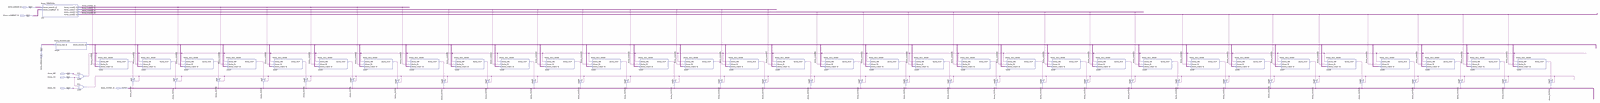
[diagram p0: schematic sheet, whole]
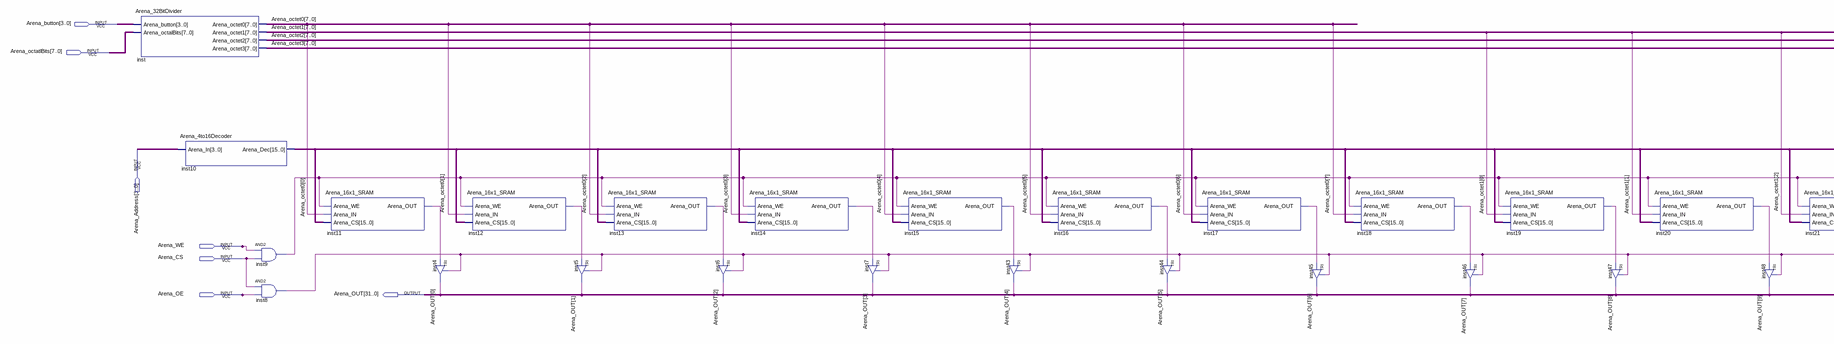
[diagram p1: schematic sheet, left part]
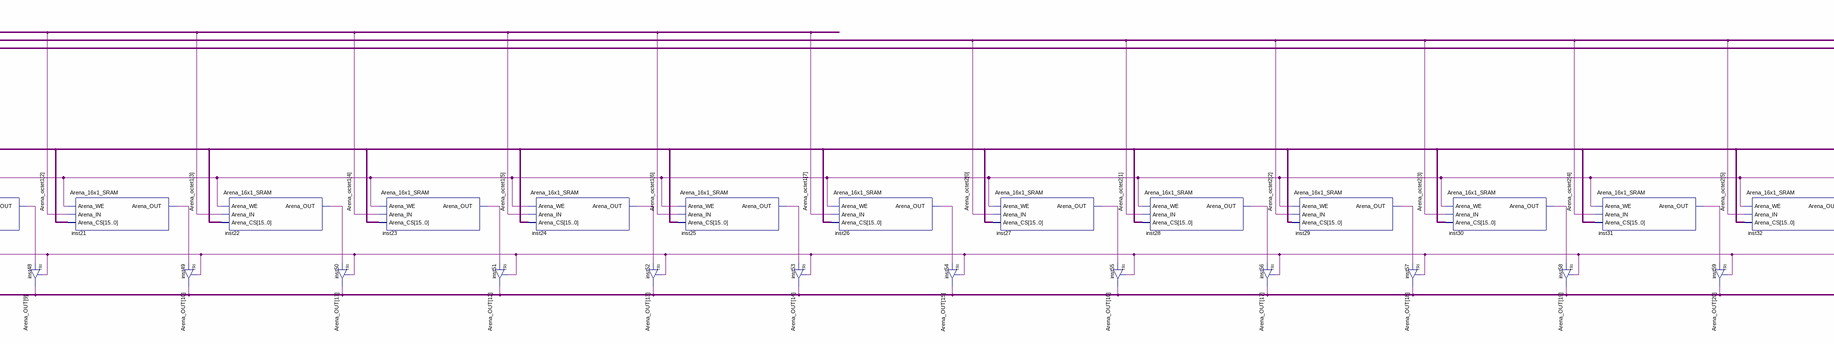
[diagram p2: schematic sheet, centre part]
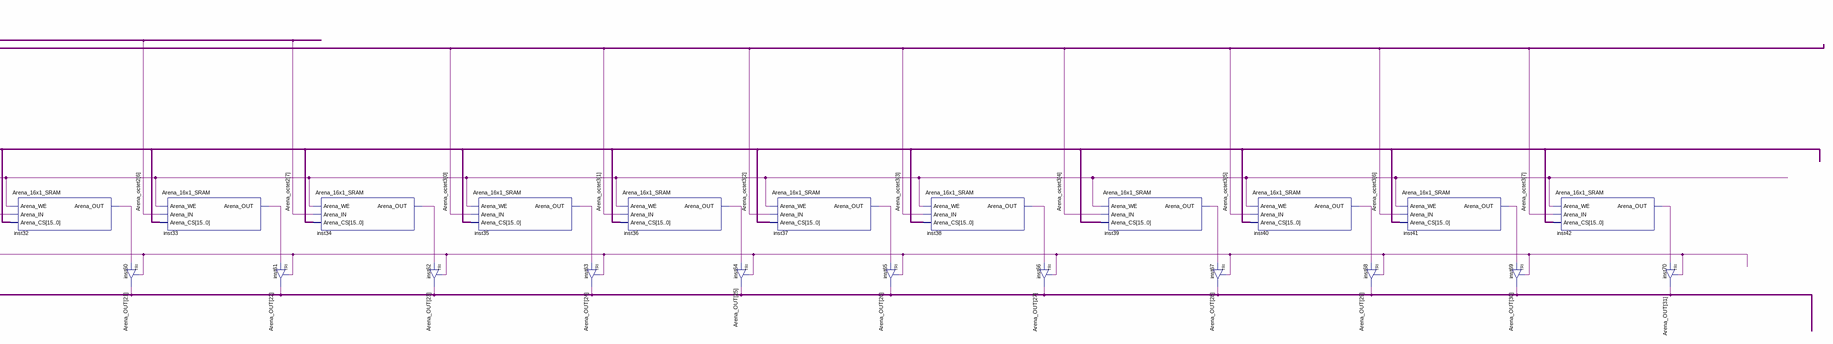
[diagram p3: schematic sheet, right part]
// Quartus schematic Arena_16x32_SRAM.bdf as structural Verilog: 68 symbols, 7 pins
module Arena_16x32_SRAM (
  input  [3:0] Arena_button,
  input  [7:0] Arena_octatlBits,
  input  [3:0] Arena_Address,
  input  Arena_WE,
  input  Arena_CS,
  input  Arena_OE,
  output [31:0] Arena_OUT
);

  wire inst8_out, inst9_out, inst11_arena_out, inst12_arena_out, inst13_arena_out, inst14_arena_out,
       inst15_arena_out, inst16_arena_out, inst17_arena_out, inst18_arena_out, inst19_arena_out,
       inst20_arena_out, inst21_arena_out, inst22_arena_out, inst23_arena_out, inst24_arena_out,
       inst25_arena_out, inst26_arena_out, inst27_arena_out, inst28_arena_out, inst29_arena_out,
       inst30_arena_out, inst31_arena_out, inst32_arena_out, inst33_arena_out, inst34_arena_out,
       inst35_arena_out, inst36_arena_out, inst37_arena_out, inst38_arena_out, inst39_arena_out,
       inst40_arena_out, inst41_arena_out, inst42_arena_out;
  wire [7:0] Arena_octet0, Arena_octet1, Arena_octet2, Arena_octet3;
  wire [15:0] inst10_arena_dec;

  Arena_32BitDivider inst (
    .Arena_button(Arena_button), .Arena_octalBits(Arena_octatlBits), .Arena_octet0(Arena_octet0),
    .Arena_octet1(Arena_octet1), .Arena_octet2(Arena_octet2), .Arena_octet3(Arena_octet3));
  Arena_4to16Decoder inst10 (.Arena_In(Arena_Address), .Arena_Dec(inst10_arena_dec));
  and inst9 (inst9_out, Arena_WE, Arena_CS);
  and inst8 (inst8_out, Arena_CS, Arena_OE);
  Arena_16x1_SRAM inst11 (
    .Arena_WE(inst9_out), .Arena_IN(Arena_octet0[0]), .Arena_CS(inst10_arena_dec),
    .Arena_OUT(inst11_arena_out));
  TRI inst4 (.IN(inst11_arena_out), .OE(inst8_out), .OUT(Arena_OUT[0]));
  Arena_16x1_SRAM inst12 (
    .Arena_WE(inst9_out), .Arena_IN(Arena_octet0[1]), .Arena_CS(inst10_arena_dec),
    .Arena_OUT(inst12_arena_out));
  TRI inst5 (.IN(inst12_arena_out), .OE(inst8_out), .OUT(Arena_OUT[1]));
  Arena_16x1_SRAM inst13 (
    .Arena_WE(inst9_out), .Arena_IN(Arena_octet0[2]), .Arena_CS(inst10_arena_dec),
    .Arena_OUT(inst13_arena_out));
  TRI inst6 (.IN(inst13_arena_out), .OE(inst8_out), .OUT(Arena_OUT[2]));
  Arena_16x1_SRAM inst14 (
    .Arena_WE(inst9_out), .Arena_IN(Arena_octet0[3]), .Arena_CS(inst10_arena_dec),
    .Arena_OUT(inst14_arena_out));
  TRI inst7 (.IN(inst14_arena_out), .OE(inst8_out), .OUT(Arena_OUT[3]));
  Arena_16x1_SRAM inst15 (
    .Arena_WE(inst9_out), .Arena_IN(Arena_octet0[4]), .Arena_CS(inst10_arena_dec),
    .Arena_OUT(inst15_arena_out));
  TRI inst43 (.IN(inst15_arena_out), .OE(inst8_out), .OUT(Arena_OUT[4]));
  Arena_16x1_SRAM inst16 (
    .Arena_WE(inst9_out), .Arena_IN(Arena_octet0[5]), .Arena_CS(inst10_arena_dec),
    .Arena_OUT(inst16_arena_out));
  TRI inst44 (.IN(inst16_arena_out), .OE(inst8_out), .OUT(Arena_OUT[5]));
  Arena_16x1_SRAM inst17 (
    .Arena_WE(inst9_out), .Arena_IN(Arena_octet0[6]), .Arena_CS(inst10_arena_dec),
    .Arena_OUT(inst17_arena_out));
  TRI inst45 (.IN(inst17_arena_out), .OE(inst8_out), .OUT(Arena_OUT[6]));
  Arena_16x1_SRAM inst18 (
    .Arena_WE(inst9_out), .Arena_IN(Arena_octet0[7]), .Arena_CS(inst10_arena_dec),
    .Arena_OUT(inst18_arena_out));
  TRI inst46 (.IN(inst18_arena_out), .OE(inst8_out), .OUT(Arena_OUT[7]));
  Arena_16x1_SRAM inst19 (
    .Arena_WE(inst9_out), .Arena_IN(Arena_octet1[0]), .Arena_CS(inst10_arena_dec),
    .Arena_OUT(inst19_arena_out));
  TRI inst47 (.IN(inst19_arena_out), .OE(inst8_out), .OUT(Arena_OUT[8]));
  Arena_16x1_SRAM inst20 (
    .Arena_WE(inst9_out), .Arena_IN(Arena_octet1[1]), .Arena_CS(inst10_arena_dec),
    .Arena_OUT(inst20_arena_out));
  TRI inst48 (.IN(inst20_arena_out), .OE(inst8_out), .OUT(Arena_OUT[9]));
  Arena_16x1_SRAM inst21 (
    .Arena_WE(inst9_out), .Arena_IN(Arena_octet1[2]), .Arena_CS(inst10_arena_dec),
    .Arena_OUT(inst21_arena_out));
  TRI inst49 (.IN(inst21_arena_out), .OE(inst8_out), .OUT(Arena_OUT[10]));
  Arena_16x1_SRAM inst22 (
    .Arena_WE(inst9_out), .Arena_IN(Arena_octet1[3]), .Arena_CS(inst10_arena_dec),
    .Arena_OUT(inst22_arena_out));
  TRI inst50 (.IN(inst22_arena_out), .OE(inst8_out), .OUT(Arena_OUT[11]));
  Arena_16x1_SRAM inst23 (
    .Arena_WE(inst9_out), .Arena_IN(Arena_octet1[4]), .Arena_CS(inst10_arena_dec),
    .Arena_OUT(inst23_arena_out));
  TRI inst51 (.IN(inst23_arena_out), .OE(inst8_out), .OUT(Arena_OUT[12]));
  Arena_16x1_SRAM inst24 (
    .Arena_WE(inst9_out), .Arena_IN(Arena_octet1[5]), .Arena_CS(inst10_arena_dec),
    .Arena_OUT(inst24_arena_out));
  TRI inst52 (.IN(inst24_arena_out), .OE(inst8_out), .OUT(Arena_OUT[13]));
  Arena_16x1_SRAM inst25 (
    .Arena_WE(inst9_out), .Arena_IN(Arena_octet1[6]), .Arena_CS(inst10_arena_dec),
    .Arena_OUT(inst25_arena_out));
  TRI inst53 (.IN(inst25_arena_out), .OE(inst8_out), .OUT(Arena_OUT[14]));
  Arena_16x1_SRAM inst26 (
    .Arena_WE(inst9_out), .Arena_IN(Arena_octet1[7]), .Arena_CS(inst10_arena_dec),
    .Arena_OUT(inst26_arena_out));
  TRI inst54 (.IN(inst26_arena_out), .OE(inst8_out), .OUT(Arena_OUT[15]));
  Arena_16x1_SRAM inst27 (
    .Arena_WE(inst9_out), .Arena_IN(Arena_octet2[0]), .Arena_CS(inst10_arena_dec),
    .Arena_OUT(inst27_arena_out));
  TRI inst55 (.IN(inst27_arena_out), .OE(inst8_out), .OUT(Arena_OUT[16]));
  Arena_16x1_SRAM inst28 (
    .Arena_WE(inst9_out), .Arena_IN(Arena_octet2[1]), .Arena_CS(inst10_arena_dec),
    .Arena_OUT(inst28_arena_out));
  TRI inst56 (.IN(inst28_arena_out), .OE(inst8_out), .OUT(Arena_OUT[17]));
  Arena_16x1_SRAM inst29 (
    .Arena_WE(inst9_out), .Arena_IN(Arena_octet2[2]), .Arena_CS(inst10_arena_dec),
    .Arena_OUT(inst29_arena_out));
  TRI inst57 (.IN(inst29_arena_out), .OE(inst8_out), .OUT(Arena_OUT[18]));
  Arena_16x1_SRAM inst30 (
    .Arena_WE(inst9_out), .Arena_IN(Arena_octet2[3]), .Arena_CS(inst10_arena_dec),
    .Arena_OUT(inst30_arena_out));
  TRI inst58 (.IN(inst30_arena_out), .OE(inst8_out), .OUT(Arena_OUT[19]));
  Arena_16x1_SRAM inst31 (
    .Arena_WE(inst9_out), .Arena_IN(Arena_octet2[4]), .Arena_CS(inst10_arena_dec),
    .Arena_OUT(inst31_arena_out));
  TRI inst59 (.IN(inst31_arena_out), .OE(inst8_out), .OUT(Arena_OUT[20]));
  Arena_16x1_SRAM inst32 (
    .Arena_WE(inst9_out), .Arena_IN(Arena_octet2[5]), .Arena_CS(inst10_arena_dec),
    .Arena_OUT(inst32_arena_out));
  TRI inst60 (.IN(inst32_arena_out), .OE(inst8_out), .OUT(Arena_OUT[21]));
  Arena_16x1_SRAM inst33 (
    .Arena_WE(inst9_out), .Arena_IN(Arena_octet2[6]), .Arena_CS(inst10_arena_dec),
    .Arena_OUT(inst33_arena_out));
  TRI inst61 (.IN(inst33_arena_out), .OE(inst8_out), .OUT(Arena_OUT[22]));
  Arena_16x1_SRAM inst34 (
    .Arena_WE(inst9_out), .Arena_IN(Arena_octet2[7]), .Arena_CS(inst10_arena_dec),
    .Arena_OUT(inst34_arena_out));
  TRI inst62 (.IN(inst34_arena_out), .OE(inst8_out), .OUT(Arena_OUT[23]));
  Arena_16x1_SRAM inst35 (
    .Arena_WE(inst9_out), .Arena_IN(Arena_octet3[0]), .Arena_CS(inst10_arena_dec),
    .Arena_OUT(inst35_arena_out));
  TRI inst63 (.IN(inst35_arena_out), .OE(inst8_out), .OUT(Arena_OUT[24]));
  Arena_16x1_SRAM inst36 (
    .Arena_WE(inst9_out), .Arena_IN(Arena_octet3[1]), .Arena_CS(inst10_arena_dec),
    .Arena_OUT(inst36_arena_out));
  TRI inst64 (.IN(inst36_arena_out), .OE(inst8_out), .OUT(Arena_OUT[25]));
  Arena_16x1_SRAM inst37 (
    .Arena_WE(inst9_out), .Arena_IN(Arena_octet3[2]), .Arena_CS(inst10_arena_dec),
    .Arena_OUT(inst37_arena_out));
  TRI inst65 (.IN(inst37_arena_out), .OE(inst8_out), .OUT(Arena_OUT[26]));
  Arena_16x1_SRAM inst38 (
    .Arena_WE(inst9_out), .Arena_IN(Arena_octet3[3]), .Arena_CS(inst10_arena_dec),
    .Arena_OUT(inst38_arena_out));
  TRI inst66 (.IN(inst38_arena_out), .OE(inst8_out), .OUT(Arena_OUT[27]));
  Arena_16x1_SRAM inst39 (
    .Arena_WE(inst9_out), .Arena_IN(Arena_octet3[4]), .Arena_CS(inst10_arena_dec),
    .Arena_OUT(inst39_arena_out));
  TRI inst67 (.IN(inst39_arena_out), .OE(inst8_out), .OUT(Arena_OUT[28]));
  Arena_16x1_SRAM inst40 (
    .Arena_WE(inst9_out), .Arena_IN(Arena_octet3[5]), .Arena_CS(inst10_arena_dec),
    .Arena_OUT(inst40_arena_out));
  TRI inst68 (.IN(inst40_arena_out), .OE(inst8_out), .OUT(Arena_OUT[29]));
  Arena_16x1_SRAM inst41 (
    .Arena_WE(inst9_out), .Arena_IN(Arena_octet3[6]), .Arena_CS(inst10_arena_dec),
    .Arena_OUT(inst41_arena_out));
  TRI inst69 (.IN(inst41_arena_out), .OE(inst8_out), .OUT(Arena_OUT[30]));
  Arena_16x1_SRAM inst42 (
    .Arena_WE(inst9_out), .Arena_IN(Arena_octet3[7]), .Arena_CS(inst10_arena_dec),
    .Arena_OUT(inst42_arena_out));
  TRI inst70 (.IN(inst42_arena_out), .OE(inst8_out), .OUT(Arena_OUT[31]));
endmodule
